# Altium schematic sheet Full_Module.SchDoc: <Document>
size Tabloid; Engineer: <Engineer>; Organization: UPEL; Address1: USU Power Electronics Lab; Address2: USTAR Building 620, RM 118; Address3: 1600 N 620 E; Address4: North Logan, UT 84341; DocumentNumber: 9; Revision: v1; SheetNumber: 9; SheetTotal: 16; ProjectName: <Project>
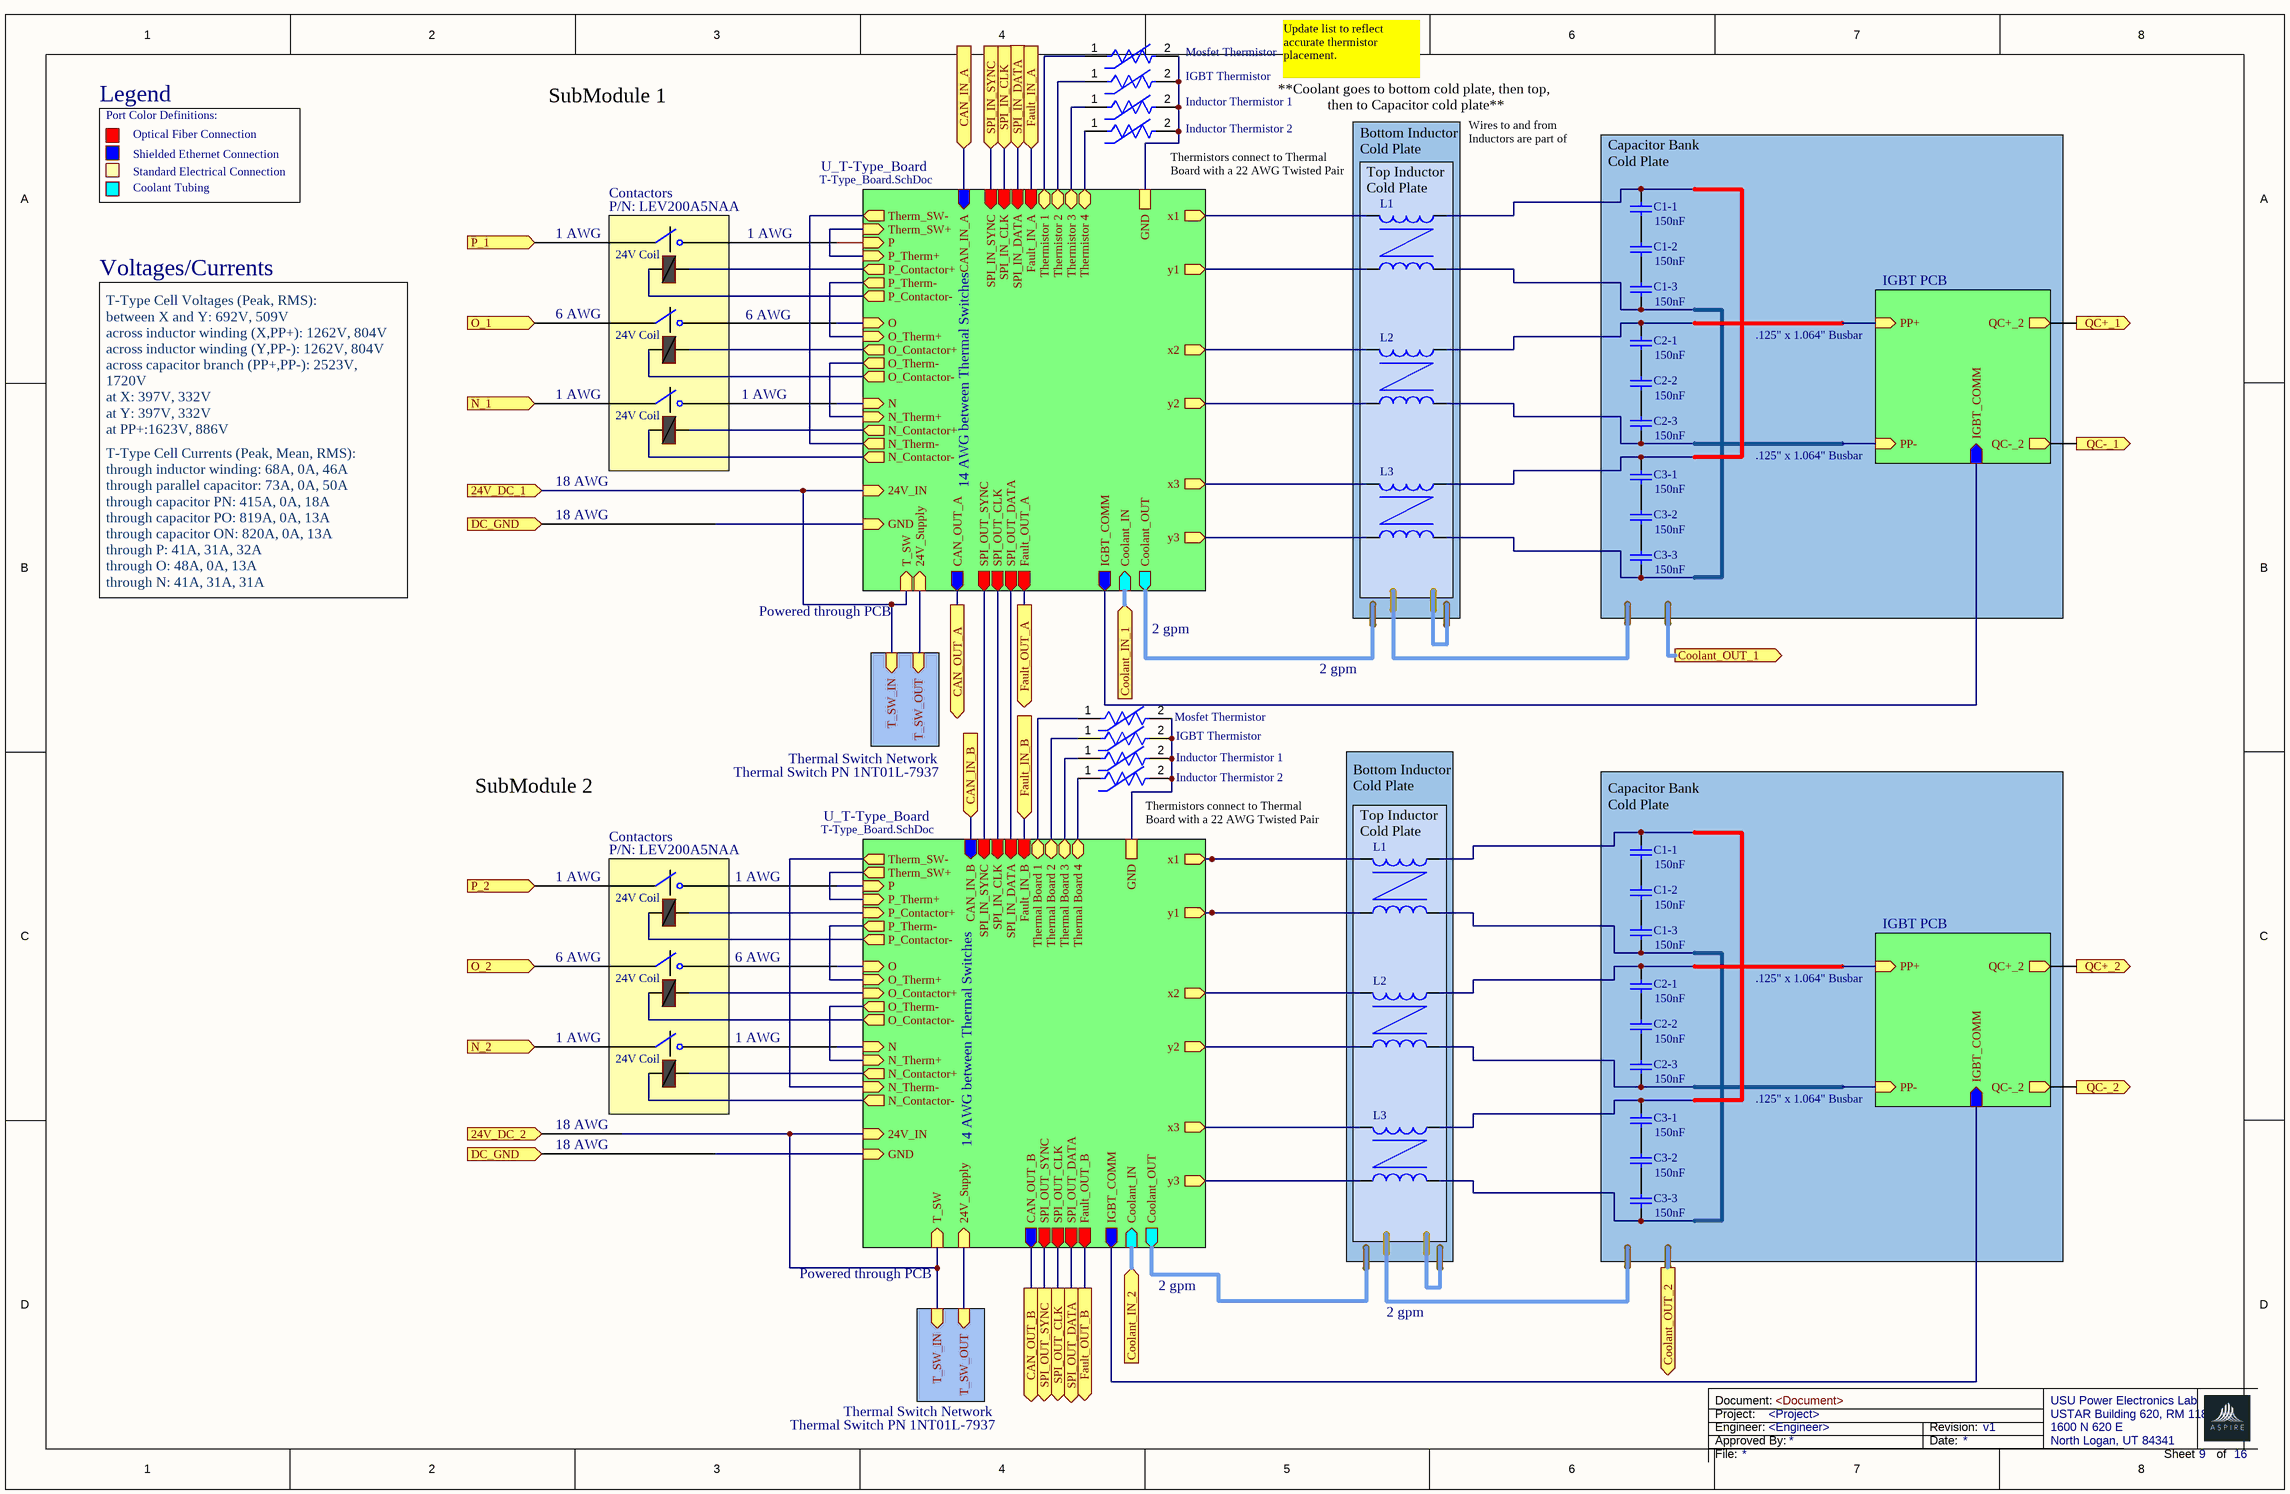
[diagram p0: Full_Module.SchDoc]

## Parts
(Parts that share a designator on the sheet are numbered #1, #2 ... from top to bottom, then left to right.)
C1-1#1  value 150nF  [RAD-0.3]  (hidden comment: Cap)
C1-1#2  value 150nF  [RAD-0.3]  (hidden comment: Cap)
C1-2#1  value 150nF  [RAD-0.3]  (hidden comment: Cap)
C1-2#2  value 150nF  [RAD-0.3]  (hidden comment: Cap)
C1-3#1  value 150nF  [RAD-0.3]  (hidden comment: Cap)
C1-3#2  value 150nF  [RAD-0.3]  (hidden comment: Cap)
C2-1#1  value 150nF  [RAD-0.3]  (hidden comment: Cap)
C2-1#2  value 150nF  [RAD-0.3]  (hidden comment: Cap)
C2-2#1  value 150nF  [RAD-0.3]  (hidden comment: Cap)
C2-2#2  value 150nF  [RAD-0.3]  (hidden comment: Cap)
C2-3#1  value 150nF  [RAD-0.3]  (hidden comment: Cap)
C2-3#2  value 150nF  [RAD-0.3]  (hidden comment: Cap)
C3-1#1  value 150nF  [RAD-0.3]  (hidden comment: Cap)
C3-1#2  value 150nF  [RAD-0.3]  (hidden comment: Cap)
C3-2#1  value 150nF  [RAD-0.3]  (hidden comment: Cap)
C3-2#2  value 150nF  [RAD-0.3]  (hidden comment: Cap)
C3-3#1  value 150nF  [RAD-0.3]  (hidden comment: Cap)
C3-3#2  value 150nF  [RAD-0.3]  (hidden comment: Cap)
IGBT_Thermistor#1  NTCALUG01A103J  [FP-NTCALUG01A103J-MFG]  (value not drawn)
IGBT_Thermistor#2  NTCALUG01A103J  [FP-NTCALUG01A103J-MFG]  (value not drawn)
Inductor_Thermistor_1#1  NTCALUG01A103J  [FP-NTCALUG01A103J-MFG]  (value not drawn)
Inductor_Thermistor_1#2  NTCALUG01A103J  [FP-NTCALUG01A103J-MFG]  (value not drawn)
Inductor_Thermistor_2#1  NTCALUG01A103J  [FP-NTCALUG01A103J-MFG]  (value not drawn)
Inductor_Thermistor_2#2  NTCALUG01A103J  [FP-NTCALUG01A103J-MFG]  (value not drawn)
K?#1  Contactor  (value not drawn)
K?#2  Contactor  (value not drawn)
K?#3  Contactor  (value not drawn)
K?#4  Contactor  (value not drawn)
K?#5  Contactor  (value not drawn)
K?#6  Contactor  (value not drawn)
L1#1  Inductor  [0402-A]  (value not drawn)
L1#2  Inductor  [0402-A]  (value not drawn)
L2#1  Inductor  [0402-A]  (value not drawn)
L2#2  Inductor  [0402-A]  (value not drawn)
L3#1  Inductor  [0402-A]  (value not drawn)
L3#2  Inductor  [0402-A]  (value not drawn)
L?#1  Inductor  [0402-A]  (value not drawn)
L?#2  Inductor  [0402-A]  (value not drawn)
L?#3  Inductor  [0402-A]  (value not drawn)
L?#4  Inductor  [0402-A]  (value not drawn)
L?#5  Inductor  [0402-A]  (value not drawn)
L?#6  Inductor  [0402-A]  (value not drawn)
Mosfet_Thermistor#1  NTCALUG01A103J  [FP-NTCALUG01A103J-MFG]  (value not drawn)
Mosfet_Thermistor#2  NTCALUG01A103J  [FP-NTCALUG01A103J-MFG]  (value not drawn)

## Sub-sheets
IGBT PCB = T-Type_Board.SchDoc: QC+_2 (out), QC-_2 (out), PP+ (in), PP- (in), IGBT_COMM (in)
IGBT PCB = T-Type_Board.SchDoc: QC+_2 (out), QC-_2 (out), PP+ (in), PP- (in), IGBT_COMM (in)
Thermal Switch Network = File Name: T_SW_OUT (in), T_SW_IN (in)
Thermal Switch Network = File Name: T_SW_OUT (in), T_SW_IN (in)
U_T-Type_Board = T-Type_Board.SchDoc: P (in), O (in), N (in), CAN_IN_A (in), GND (in), 24V_IN (in), Coolant_IN (in), Coolant_OUT (out), x1 (out), y1 (out), SPI_IN_SYNC (in), CAN_OUT_A (out), SPI_OUT_SYNC (out), Fault_OUT_A (out), SPI_OUT_CLK (out), SPI_OUT_DATA (out), SPI_IN_CLK (in), SPI_IN_DATA (in), Fault_IN_A (in), P_Contactor+ (out), P_Contactor- (out), O_Contactor+ (out), N_Contactor+ (out), O_Contactor- (out), N_Contactor- (out), x2 (out), y2 (out), x3 (out), y3 (out), T_SW (in), 24V_Supply (in), IGBT_COMM (out), P_Therm+ (in), P_Therm- (out), N_Therm- (out), N_Therm+ (in), O_Therm- (out), O_Therm+ (in), Therm_SW+ (in), Therm_SW- (out), Thermistor 4 (bidir), Thermistor 3 (bidir), Thermistor 2 (bidir), Thermistor 1 (bidir), GND
U_T-Type_Board = T-Type_Board.SchDoc: P (in), O (in), N (in), GND (in), 24V_IN (in), Coolant_IN (in), Coolant_OUT (out), SPI_IN_SYNC (in), SPI_OUT_SYNC (out), Fault_OUT_B (out), CAN_OUT_B (out), SPI_OUT_CLK (out), SPI_OUT_DATA (out), CAN_IN_B (in), SPI_IN_CLK (in), SPI_IN_DATA (in), Fault_IN_B (in), P_Contactor+ (in), P_Contactor- (out), O_Contactor+ (in), N_Contactor+ (out), O_Contactor- (out), N_Contactor- (out), x1 (out), y1 (out), x2 (out), y2 (out), x3 (out), y3 (out), T_SW (in), 24V_Supply (in), IGBT_COMM (out), N_Therm+ (in), N_Therm- (in), O_Therm+ (in), O_Therm- (out), P_Therm+ (in), P_Therm- (out), Therm_SW+ (out), Therm_SW- (out), Thermal Board 4 (bidir), Thermal Board 3 (bidir), Thermal Board 2 (bidir), Thermal Board 1 (bidir), GND

## Ports
24V_DC_1 (in), 24V_DC_2 (in), CAN_IN_A (in), CAN_IN_B (in), CAN_OUT_A (out), CAN_OUT_B (out), Coolant_IN_1 (in), Coolant_IN_2 (in), Coolant_OUT_1 (out), Coolant_OUT_2 (out), DC_GND (in), Fault_IN_A (in), Fault_IN_B (in), Fault_OUT_A (out), Fault_OUT_B (out), N_1 (in), N_2 (in), O_1 (in), O_2 (in), P_1 (in), P_2 (in), QC+_1 (out), QC+_2 (out), QC-_1 (out), QC-_2 (out), SPI_IN_CLK (in), SPI_IN_DATA (in), SPI_IN_SYNC (in), SPI_OUT_CLK (out), SPI_OUT_DATA (out), SPI_OUT_SYNC (out)

## Nets
24V_DC_1: port 24V_DC_1, sheet U_T-Type_Board/24V_IN, sheet U_T-Type_Board/T_SW, sheet Thermal Switch Network/T_SW_IN
24V_DC_2: port 24V_DC_2, sheet U_T-Type_Board/24V_IN, sheet U_T-Type_Board/T_SW, sheet Thermal Switch Network/T_SW_IN
CAN_IN_A: port CAN_IN_A, sheet U_T-Type_Board/CAN_IN_A
CAN_IN_B: port CAN_IN_B, sheet U_T-Type_Board/CAN_IN_B
CAN_OUT_A: port CAN_OUT_A, sheet U_T-Type_Board/CAN_OUT_A
CAN_OUT_B: port CAN_OUT_B, sheet U_T-Type_Board/CAN_OUT_B
Coolant_IN_1: port Coolant_IN_1, sheet U_T-Type_Board/Coolant_IN
Coolant_IN_2: port Coolant_IN_2, sheet U_T-Type_Board/Coolant_IN
DC_GND: port DC_GND, sheet U_T-Type_Board/GND, sheet U_T-Type_Board/GND
Fault_IN_A: port Fault_IN_A, sheet U_T-Type_Board/Fault_IN_A
Fault_IN_B: port Fault_IN_B, sheet U_T-Type_Board/Fault_IN_B
Fault_OUT_A: port Fault_OUT_A, sheet U_T-Type_Board/Fault_OUT_A
Fault_OUT_B: port Fault_OUT_B, sheet U_T-Type_Board/Fault_OUT_B
N_1: K?#3.3 ; port N_1
N_2: K?#6.3 ; port N_2
O_1: K?#2.3 ; port O_1
O_2: K?#5.3 ; port O_2
P_1: K?#1.3 ; port P_1
P_2: K?#4.3 ; port P_2
QC+_1: port QC+_1, sheet IGBT PCB/QC+_2
QC+_2: port QC+_2, sheet IGBT PCB/QC+_2
QC-_1: port QC-_1, sheet IGBT PCB/QC-_2
QC-_2: port QC-_2, sheet IGBT PCB/QC-_2
SPI_IN_CLK: port SPI_IN_CLK, sheet U_T-Type_Board/SPI_IN_CLK
SPI_IN_DATA: port SPI_IN_DATA, sheet U_T-Type_Board/SPI_IN_DATA
SPI_IN_SYNC: port SPI_IN_SYNC, sheet U_T-Type_Board/SPI_IN_SYNC
SPI_OUT_CLK: port SPI_OUT_CLK, sheet U_T-Type_Board/SPI_OUT_CLK
SPI_OUT_DATA: port SPI_OUT_DATA, sheet U_T-Type_Board/SPI_OUT_DATA
SPI_OUT_SYNC: port SPI_OUT_SYNC, sheet U_T-Type_Board/SPI_OUT_SYNC
NetC1-1#1_1: C1-1#1.1 C1-2#1.2
NetC1-1#1_2: C1-1#1.2 C3-1#1.2 L1#1.1 L3#1.1
NetC1-1#2_1: C1-1#2.1 C1-2#2.2
NetC1-1#2_2: C1-1#2.2 C3-1#2.2 L1#2.1 L3#2.1
NetC1-2#1_1: C1-2#1.1 C1-3#1.2
NetC1-2#2_1: C1-2#2.1 C1-3#2.2
NetC1-3#1_1: C1-3#1.1 C3-3#1.1 L?#1.2 L?#3.2
NetC1-3#2_1: C1-3#2.1 C3-3#2.1 L?#4.2 L?#6.2
NetC2-1#1_1: C2-1#1.1 C2-2#1.2
NetC2-1#1_2: C2-1#1.2 L2#1.1 ; sheet IGBT PCB/PP+
NetC2-1#2_1: C2-1#2.1 C2-2#2.2
NetC2-1#2_2: C2-1#2.2 L2#2.1 ; sheet IGBT PCB/PP+
NetC2-2#1_1: C2-2#1.1 C2-3#1.2
NetC2-2#2_1: C2-2#2.1 C2-3#2.2
NetC2-3#1_1: C2-3#1.1 L?#2.2 ; sheet IGBT PCB/PP-
NetC2-3#2_1: C2-3#2.1 L?#5.2 ; sheet IGBT PCB/PP-
NetC3-1#1_1: C3-1#1.1 C3-2#1.2
NetC3-1#2_1: C3-1#2.1 C3-2#2.2
NetC3-2#1_1: C3-2#1.1 C3-3#1.2
NetC3-2#2_1: C3-2#2.1 C3-3#2.2
NetIGBT_Thermistor#1_1: IGBT_Thermistor#1.1 ; sheet U_T-Type_Board/Thermistor 2
NetIGBT_Thermistor#1_2: IGBT_Thermistor#1.2 Inductor_Thermistor_1#1.2 Inductor_Thermistor_2#1.2 Mosfet_Thermistor#1.2 ; sheet U_T-Type_Board/GND
NetIGBT_Thermistor#2_1: IGBT_Thermistor#2.1 ; sheet U_T-Type_Board/Thermal Board 2
NetIGBT_Thermistor#2_2: IGBT_Thermistor#2.2 Inductor_Thermistor_1#2.2 Inductor_Thermistor_2#2.2 Mosfet_Thermistor#2.2 ; sheet U_T-Type_Board/GND
NetInductor_Thermistor_1#1_1: Inductor_Thermistor_1#1.1 ; sheet U_T-Type_Board/Thermistor 3
NetInductor_Thermistor_1#2_1: Inductor_Thermistor_1#2.1 ; sheet U_T-Type_Board/Thermal Board 3
NetInductor_Thermistor_2#1_1: Inductor_Thermistor_2#1.1 ; sheet U_T-Type_Board/Thermistor 4
NetInductor_Thermistor_2#2_1: Inductor_Thermistor_2#2.1 ; sheet U_T-Type_Board/Thermal Board 4
NetK?#1_4: K?#1.4 ; sheet U_T-Type_Board/P
NetK?#1_5: K?#1.5 ; sheet U_T-Type_Board/P_Contactor+
NetK?#1_6: K?#1.6 ; sheet U_T-Type_Board/P_Contactor-
NetK?#2_4: K?#2.4 ; sheet U_T-Type_Board/O
NetK?#2_5: K?#2.5 ; sheet U_T-Type_Board/O_Contactor+
NetK?#2_6: K?#2.6 ; sheet U_T-Type_Board/O_Contactor-
NetK?#3_4: K?#3.4 ; sheet U_T-Type_Board/N
NetK?#3_5: K?#3.5 ; sheet U_T-Type_Board/N_Contactor+
NetK?#3_6: K?#3.6 ; sheet U_T-Type_Board/N_Contactor-
NetK?#4_4: K?#4.4 ; sheet U_T-Type_Board/P
NetK?#4_5: K?#4.5 ; sheet U_T-Type_Board/P_Contactor+
NetK?#4_6: K?#4.6 ; sheet U_T-Type_Board/P_Contactor-
NetK?#5_4: K?#5.4 ; sheet U_T-Type_Board/O
NetK?#5_5: K?#5.5 ; sheet U_T-Type_Board/O_Contactor+
NetK?#5_6: K?#5.6 ; sheet U_T-Type_Board/O_Contactor-
NetK?#6_4: K?#6.4 ; sheet U_T-Type_Board/N
NetK?#6_5: K?#6.5 ; sheet U_T-Type_Board/N_Contactor+
NetK?#6_6: K?#6.6 ; sheet U_T-Type_Board/N_Contactor-
NetL1#1_2: L1#1.2 ; sheet U_T-Type_Board/x1
NetL1#2_2: L1#2.2 ; sheet U_T-Type_Board/x1
NetL2#1_2: L2#1.2 ; sheet U_T-Type_Board/x2
NetL2#2_2: L2#2.2 ; sheet U_T-Type_Board/x2
NetL3#1_2: L3#1.2 ; sheet U_T-Type_Board/x3
NetL3#2_2: L3#2.2 ; sheet U_T-Type_Board/x3
NetL?#1_1: L?#1.1 ; sheet U_T-Type_Board/y1
NetL?#2_1: L?#2.1 ; sheet U_T-Type_Board/y2
NetL?#3_1: L?#3.1 ; sheet U_T-Type_Board/y3
NetL?#4_1: L?#4.1 ; sheet U_T-Type_Board/y1
NetL?#5_1: L?#5.1 ; sheet U_T-Type_Board/y2
NetL?#6_1: L?#6.1 ; sheet U_T-Type_Board/y3
NetMosfet_Thermistor#1_1: Mosfet_Thermistor#1.1 ; sheet U_T-Type_Board/Thermistor 1
NetMosfet_Thermistor#2_1: Mosfet_Thermistor#2.1 ; sheet U_T-Type_Board/Thermal Board 1
(unnamed): sheet U_T-Type_Board/SPI_OUT_SYNC, sheet U_T-Type_Board/SPI_IN_SYNC
(unnamed): sheet U_T-Type_Board/SPI_OUT_CLK, sheet U_T-Type_Board/SPI_IN_CLK
(unnamed): sheet U_T-Type_Board/SPI_OUT_DATA, sheet U_T-Type_Board/SPI_IN_DATA
(unnamed): sheet U_T-Type_Board/24V_Supply, sheet Thermal Switch Network/T_SW_OUT
(unnamed): sheet U_T-Type_Board/IGBT_COMM, sheet IGBT PCB/IGBT_COMM
(unnamed): sheet U_T-Type_Board/P_Therm+, sheet U_T-Type_Board/Therm_SW+
(unnamed): sheet U_T-Type_Board/P_Therm-, sheet U_T-Type_Board/O_Therm+
(unnamed): sheet U_T-Type_Board/N_Therm-, sheet U_T-Type_Board/Therm_SW-
(unnamed): sheet U_T-Type_Board/N_Therm+, sheet U_T-Type_Board/O_Therm-
(unnamed): sheet U_T-Type_Board/24V_Supply, sheet Thermal Switch Network/T_SW_OUT
(unnamed): sheet U_T-Type_Board/IGBT_COMM, sheet IGBT PCB/IGBT_COMM
(unnamed): sheet U_T-Type_Board/N_Therm+, sheet U_T-Type_Board/O_Therm-
(unnamed): sheet U_T-Type_Board/N_Therm-, sheet U_T-Type_Board/Therm_SW-
(unnamed): sheet U_T-Type_Board/O_Therm+, sheet U_T-Type_Board/P_Therm-
(unnamed): sheet U_T-Type_Board/P_Therm+, sheet U_T-Type_Board/Therm_SW+

## Notes on the sheet
- Legend
- SubModule 1
- Update list to reflect accurate thermistor placement.
- Port Color Definitions:
- Optical Fiber Connection
- Shielded Ethernet Connection
- Standard Electrical Connection
- **Coolant goes to bottom cold plate, then top,
  then to Capacitor cold plate**
- Bottom Inductor Cold Plate
- Wires to and from Inductors are part of custom made inductors
- (near C1-1#1) Capacitor Bank Cold Plate
- Coolant Tubing
- 1 AWG
- (near K?#1) Contactors
- (near K?#1) P/N: LEV200A5NAA
- (near Inductor_Thermistor_2#1) Thermistors connect to Thermal Board with a 22 AWG Twisted Pair with GND
- (near L1#1) Top Inductor Cold Plate
- Voltages/Currents
- (near K?#1) 24V Coil
- 6 AWG
- (near K?#2) 24V Coil
- .125" x 1.064" Busbar
- T-Type Cell Voltages (Peak, RMS):
  between X and Y: 692V, 509V
  across inductor winding (X,PP+): 1262V, 804V
  across inductor winding (Y,PP-): 1262V, 804V
  across capacitor branch (PP+,PP-): 2523V, 1720V
  at X: 397V, 332V
  at Y: 397V, 332V
  at PP+:1623V, 886V
  at PP-: 1623V, 886V
- (near K?#3) 24V Coil
- 18 AWG
- 14 AWG between Thermal Switches
- T-Type Cell Currents (Peak, Mean, RMS):
  through inductor winding: 68A, 0A, 46A
  through parallel capacitor: 73A, 0A, 50A
  through capacitor PN: 415A, 0A, 18A
  through capacitor PO: 819A, 0A, 13A
  through capacitor ON: 820A, 0A, 13A
  through P: 41A, 31A, 32A
  through O: 48A, 0A, 13A
  through N: 41A, 31A, 31A
- Powered through PCB
- 2 gpm
- Thermal Switch PN 1NT01L-7937
- Thermal Switch Network
- SubModule 2
- (near K?#4) Contactors
- (near Inductor_Thermistor_2#2) Thermistors connect to Thermal Board with a 22 AWG Twisted Pair with GND
- (near L1#2) Top Inductor Cold Plate
- (near C1-1#2) Capacitor Bank Cold Plate
- (near K?#4) P/N: LEV200A5NAA
- (near K?#4) 24V Coil
- (near K?#4) 1 AWG
- (near K?#5) 24V Coil
- (near K?#5) 6 AWG
- (near K?#6) 1 AWG
- (near K?#6) 24V Coil
- Project:
- Engineer:
- Document:
- Approved By:
- Date:
- Revision:
- File:
- Sheet
- of

## Library data of the parts
C1-1#1 C1-1#2 C1-2#1 C1-2#2 C1-3#1 C1-3#2 C2-1#1 C2-1#2 C2-2#1 C2-2#2 C2-3#1 C2-3#2 C3-1#1 C3-1#2 C3-2#1 C3-2#2 C3-3#1 C3-3#2 = Cap: Capacitor; Published: 8-Jun-2000; LatestRevisionDate: 17-Jul-2002; LatestRevisionNote: Re-released for DXP Platform.; PackageReference: RAD-0.3; Publisher: Altium Limited; PackageDescription: Radial Cap, Thru-Hole; 2 Leads; 0.3 in Pin Spacing
IGBT_Thermistor#1 IGBT_Thermistor#2 Inductor_Thermistor_1#1 Inductor_Thermistor_1#2 Inductor_Thermistor_2#1 Inductor_Thermistor_2#2 Mosfet_Thermistor#1 Mosfet_Thermistor#2 = CMP-009-00000-2: NTC Thermistor, 10000ohm, Chassis Mount
L1#1 L1#2 L2#1 L2#2 L3#1 L3#2 L?#1-L?#6 = Inductor: Code_IEC: 1005; Value: 10mH; Published: 8-Jun-2000; LatestRevisionDate: 29-May-2009; LatestRevisionNote: IPC-7351 Footprint Added.; PackageReference: 0402-A; Publisher: Altium Limited; PackageDescription: Chip Inductor; Code_JEITA: 0402